# EAGLE design ENERGIA (EAGLE 9.5.2)
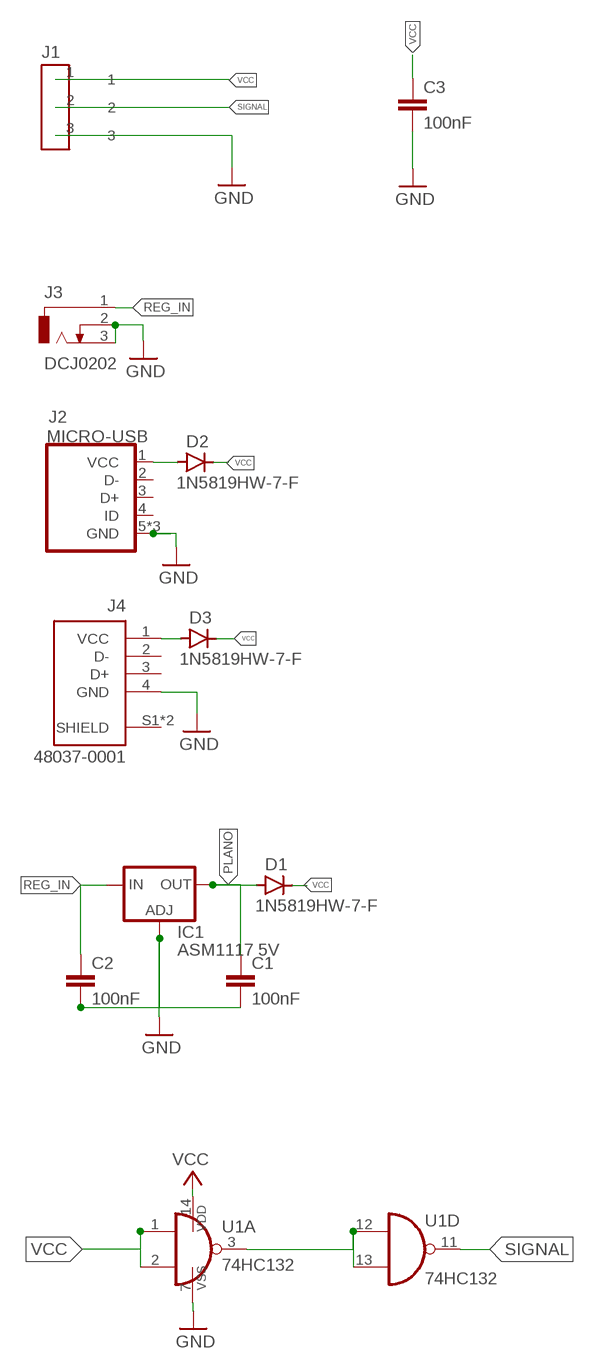
[diagram p0: schematic, sheet 1]

## Parts
C1  100nF  C-EUC0805  [C0805]
C2  100nF  C-EUC0805  [C0805]
C3  100nF  C-EUC0805  [C0805]
D1  1N5819HW-7-F  GF1  [SMA-DO214AC]
D2  1N5819HW-7-F  GF1  [SMA-DO214AC]
D3  1N5819HW-7-F  GF1  [SMA-DO214AC]
IC1  ASM1117 5V  LD117AS18TR  [SOT223]
J1  CONECTOR_FEMEA  [3CONECTOR]
J2  MICRO-USB  [MICRO-USB]
J3  DCJ0202  [DCJ0202]
J4  48037-0001  [MOLEX_48037-0001]
U1  74HC132  4011D  [SO14]

## Nets
GND: C1.2 C2.2 C3.2 IC1.1(ADJ) J1.3 J2.5(GND) J2.GND1(GND) J2.GND2(GND) J3.2 J3.3 J4.4(GND) U1.7(P:VSS)
N$2: D2.A J2.1(VCC)
N$3: U1.3(A:O) U1.12(D:I0) U1.13(D:I1)
N$4: D3.A J4.1(VCC)
PLANO: C1.1 D1.A IC1.4(OUT)
REG_IN: C2.1 IC1.3(IN) J3.1
SIGNAL: J1.2 U1.11(D:O)
VCC: C3.1 D1.K(C) D2.K(C) D3.K(C) J1.1 U1.1(A:I0) U1.2(A:I1) U1.14(P:VDD)
Unconnected: J2.2(D-) J2.3(D+) J2.4(ID) J4.2(D-) J4.3(D+) J4.S1(SHIELD) J4.S2(SHIELD) U1.4(B:O) U1.5(B:I0) U1.6(B:I1) U1.8(C:I0) U1.9(C:I1) U1.10(C:O)

## Library data of the parts
C1-C3 = rcl:C-EU: CAPACITOR, European symbol; SPICEPREFIX: C
D1-D3 = diode:GF1: DIODE
IC1 = v-reg:LD117A?*: Low drop fixed and adjustable positive voltage regulators 1 A Source: http://www.st.com/stonline/products/literature/ds/7194/ld1117axx.pdf
J1 = Eletroblocks Lib:CONECTOR_FEMEA
J2 = microusb:MICRO-USB: Micro USB B connector
J3 = con-jack:DCJ0202: DC POWER JACK Source: DCJ0202.pdf; OC_FARNELL: unknown; OC_NEWARK: unknown
J4 = USB:48037-0001: Conn.; Data; USB; Plug; Shielded; Type A; Rt. Angle; Through Hole; Gold Plating; AVAILABILITY: Unavailable; DESCRIPTION: USB-A (USB TYPE-A) USB 2.0 Plug Connector 4 Position Through Hole, Right Angle; MF: Molex; MOUSER-PURCHASE-URL: https://snapeda.com/shop?store=Mouser&id=49135; MP: 48037-0001; PACKAGE: None; PRICE: None
U1 = 40xx:4011: Quad 2-input NAND

## Board
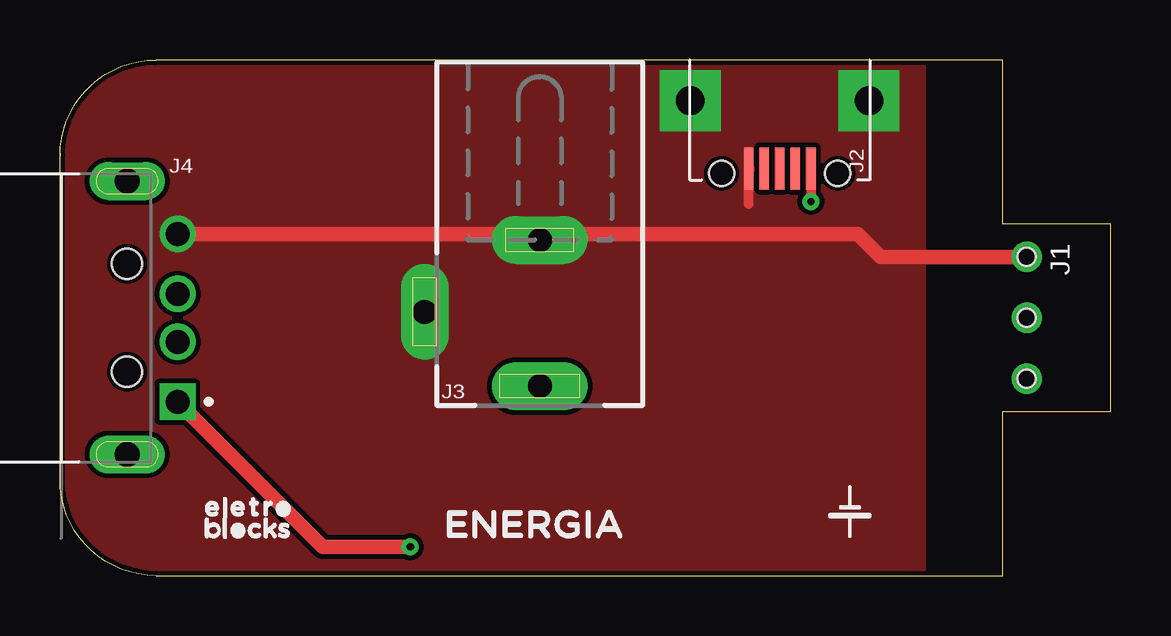
[diagram p1: board, top side]
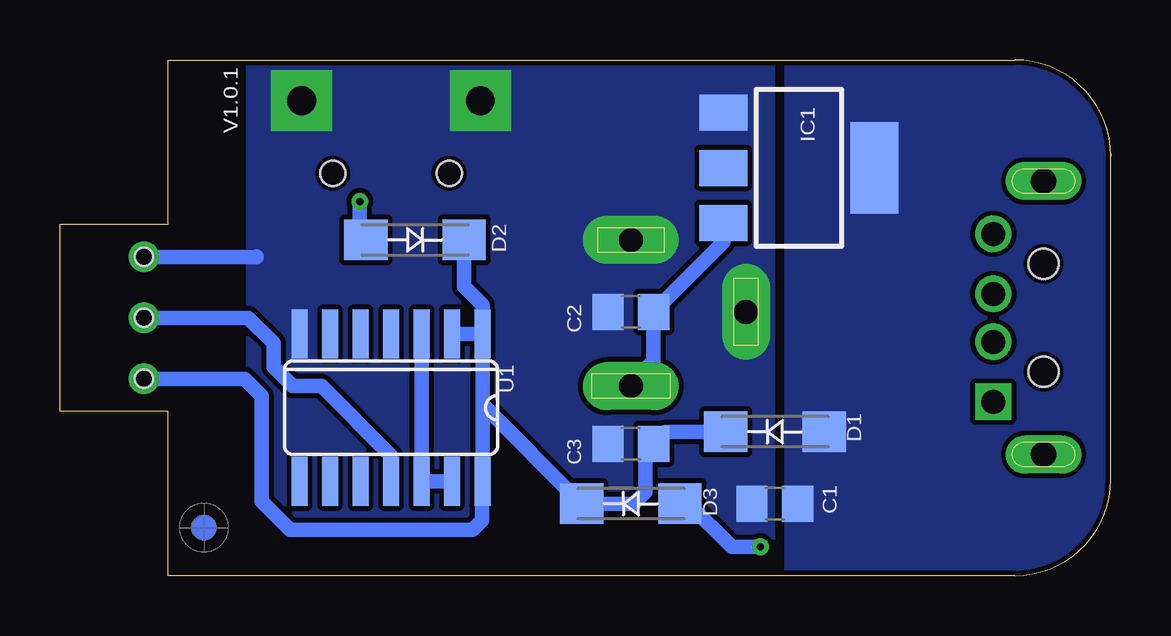
[diagram p2: board, bottom side, seen from below]

Size 43.8 x 21.5 mm. Coordinates in mm from the lower left corner, seen from the top.
Outline: 0,17.5 arc-90 4,21.5 39.3,21.5 39.3,14.65 43.8,14.65 43.8,6.85 39.3,6.85 39.3,0 4,0 arc-90 0,4 0,17.5
Outline: 0,17.6 0,17.5
Copper layers (1*16): Top 0.035mm / dielectric 1.5mm / Bottom 0.035mm
Design rules "default *": minimum track width 8mil, minimum drill 0.35mm, track to track 8mil, track to pad 8mil, pad to pad 8mil, via to via 8mil, smd to smd 8mil, copper to edge 8mil, drill to drill 8mil, minimum pad ring 10mil, minimum via ring 8mil, stop-mask expansion 4mil, vias tented up to drill 5mm, thermal gap 0mil

### Footprints (pad centres in the part's own frame; a part is rotated, then mirrored left to right if it is on the bottom)
C0805 = smd 1.3 x 1.5: 1 -0.95,0; 2 0.95,0
SMA-DO214AC = smd 1.8 x 1.7: A -2.05,0; K 2.05,0
SOT223 = smd 1.5 x 2: 1 -2.3,-3.15; 2 0,-3.15; 3 2.3,-3.15 | smd 3.8 x 2: 4 0,3.15
3CONECTOR = drill 0.75: 1 0,2.54; 2 0,0; 3 0,-2.54 | hole 0.75: 0,2.54; 0,0; 0,-2.54
MICRO-USB = smd 0.4 x 1.75: 1 -1.3,4.525; 2 -0.65,4.525; 3 0,4.525; 4 0.65,4.525; 5 1.3,4.525 | drill 1.2 pad 2.54 square: GND1 -3.725,1.7; GND2 3.725,1.7 | hole 1.05: -2.425,4.73; 2.425,4.73
DCJ0202 = drill 1 pad 2 long: 1 0,3.1; 2 4.8,0; 3 0,-3
MOLEX_48037-0001 = drill 1 square: 1 3.5,2.1 | drill 1: 2 1,2.1; 3 -1,2.1; 4 -3.5,2.1 | drill 1.05 long: S1 5.7,0; S2 -5.7,0 | hole 1.25: 2.25,0; -2.25,0
SO14 = smd 0.66 x 2.032: 1 -3.81,-3.073; 2 -2.54,-3.073; 3 -1.27,-3.073; 4 0,-3.073; 5 1.27,-3.073; 6 2.54,-3.073; 7 3.81,-3.073; 8 3.81,3.073; 9 2.54,3.073; 10 1.27,3.073; 11 0,3.073; 12 -1.27,3.073; 13 -2.54,3.073; 14 -3.81,3.073

### Placement (x,y rotation side)
C1  14,3 180 bottom
C2  20,11 180 bottom
C3  20,5.5 180 bottom
D1  14,6 180 bottom
D2  29,14 0 bottom
D3  20,3 180 bottom
IC1  13,17 270 bottom
J1  40.3,10.75 180 top
J2  30,21.5 180 top
J3  20,11 180 top
J4  2.8,10.75 270 top
U1  30,7 180 bottom
U$1  [FIDUCIAL_G10]  37.8,2 0 bottom

### Tracks (layer width: path | path; a pad name or v marks a point on that pad's centre or on a via)
GND
  Top 0.152: J2.5 28.7,16.3
  Top 0.406: 28.7,16.3 28.7,15.5
  Top 0.61: J4.4 33.25,14.25 34.21,13.29 J1.3
  Bottom 0.61: J1.3 35.61,13.29 35.6,13.3
  pour Bottom: 14.1,0 35.94,0 35.94,21.6 14.1,21.6
  pour Top: 0,22 0,-1 36,-1 36,22
N$2  (via drill 0.3)
  Top 0.406: J2.1 v31.3,15.6
  Bottom 0.61: v31.3,15.6 31.3,14.25 D2.A
N$3
  Bottom 0.61: U1.13 U1.12 U1.3
N$4  (via drill 0.3)
  Top 0.61: J4.1 10.96,1.19 v14.6,1.19
  Bottom 0.61: 18.25,2.95 18.14,2.97 D3.A 17.6,3 15.79,1.19 v14.6,1.19
PLANO
  Bottom 0.61: 9.95,16.15 9.9,16.2
  pour Bottom: 13.5,0 13.5,21.6 -0.2,21.6 -0.2,0
REG_IN
  Bottom 0.61: J3.1 20.05,7.95 19.05,8.95 C2.1 16.15,13.9 IC1.3
SIGNAL
  Bottom 0.61: J1.2 35.95,10.75 34.9,9.7 34.9,8.7 34.1,7.9 32.9,7.9 30,5 U1.11
VCC
  Bottom 0.61: J1.1 36.1,8.2 35.4,7.5 35.4,3.1 34.2,1.9 26.6,1.9 26.2,2.3 26.2,3.92 U1.14 26.19,7.14 | 26.19,7.14 U1.1 | U1.1 U1.2 | D2.K 26.95,12.05 26.19,11.29 U1.1 | 26.19,7.14 D3.K 19.9,3 19.4,3.5 19.4,5.15 C3.1 18.55,6 D1.K

### Text on the board
bPlace: V1.0.1